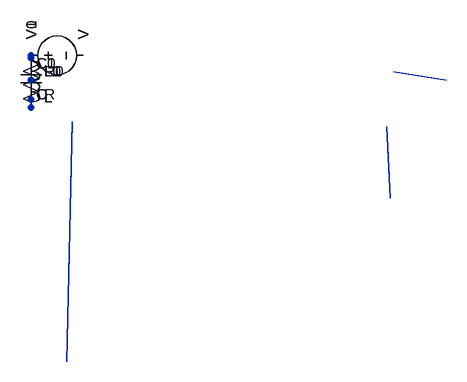
[diagram p0: schematic try4..asc]
try4..asc, the LTspice schematic file:
Version 4
SHEET 1 880 680
WIRE -1 -21 -1 17
WIRE -1 59 -1 17
WIRE -1 -17 -1 17
WIRE -1 47 -1 17
WIRE -1 -21 -1 17
WIRE -1 59 -1 17
WIRE -1 -17 -1 17
WIRE -1 47 -1 17
WIRE -1 -21 -1 17
WIRE -1 59 -1 17
WIRE -1 -21 -1 17
WIRE -1 59 -1 17
WIRE -1 -21 -1 17
WIRE -1 59 -1 17
WIRE 546 89 551 199
WIRE 54 450 62 81
WIRE 638 17 556 4
SYMBOL voltage -17 -21 R270
SYMATTR InstName V0
SYMBOL cap -17 -17 R0
SYMATTR InstName C0
SYMBOL voltage -17 -21 R270
SYMATTR InstName V1
SYMBOL cap -17 -17 R0
SYMATTR InstName C1
SYMBOL res -17 -37 R0
SYMATTR InstName R0
SYMBOL ind -17 -37 R0
SYMATTR InstName L0
SYMBOL ind -17 -37 R0
SYMATTR InstName L1

The netlist it stands for:
* try4..asc
V0 N001 P001 V
C0 N001 N001 C
V1 N001 P001 V
C1 N001 N001 C
R0 N001 N001 R
L0 N001 N001 L
L1 N001 N001 L
.backanno
.end